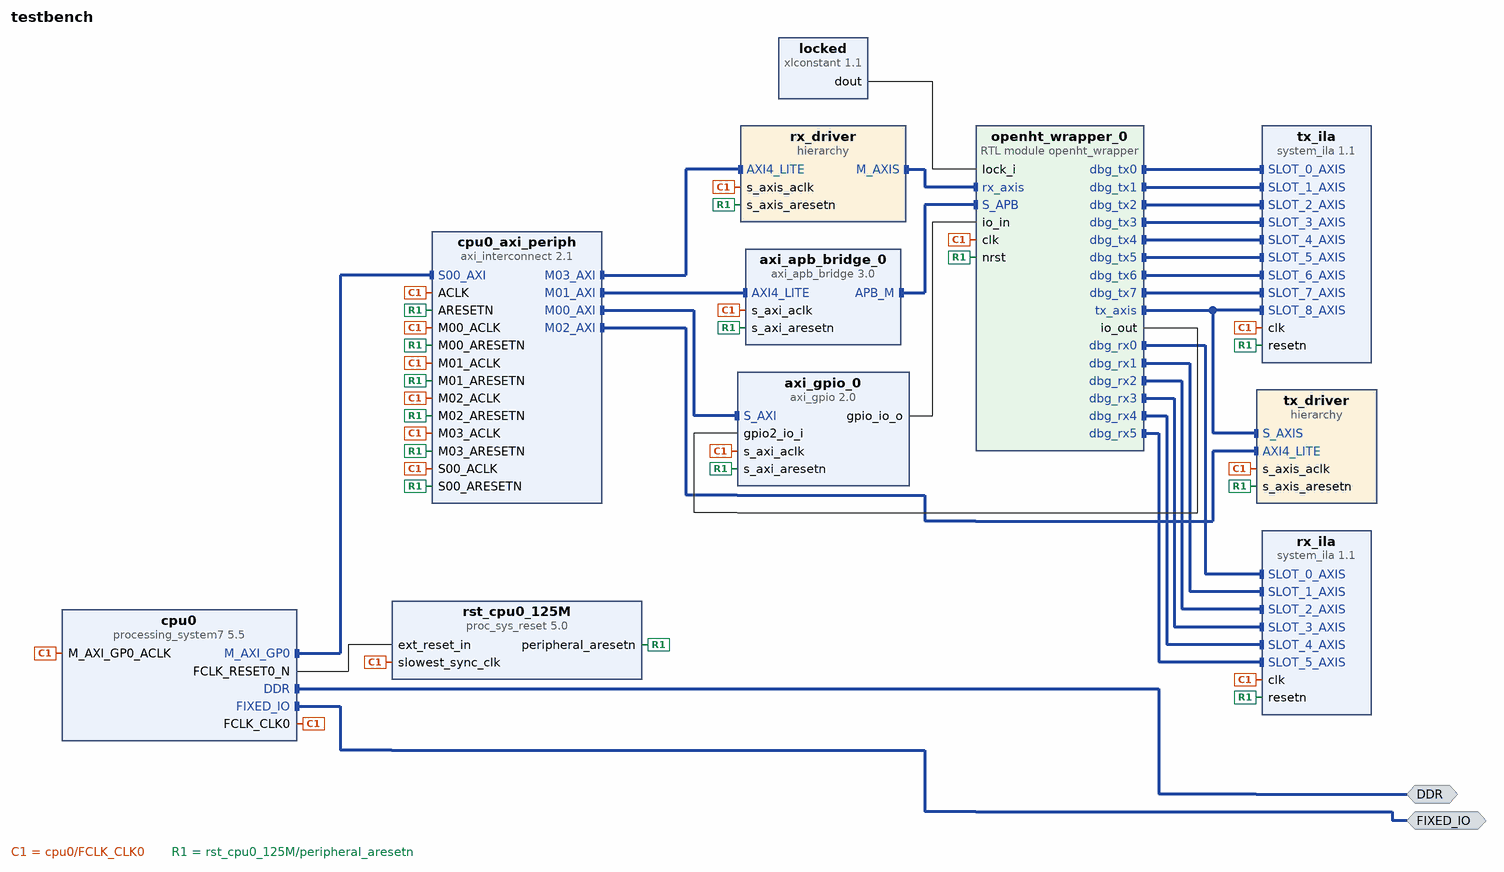
[diagram p0: block diagram of the top level]
# Vivado block design testbench, xc7z020clg400-1, Vivado 2023.1
create_bd_design testbench

create_bd_intf_port -mode Master -vlnv xilinx.com:interface:ddrx_rtl:1.0 DDR
create_bd_intf_port -mode Master -vlnv xilinx.com:display_processing_system7:fixedio_rtl:1.0 FIXED_IO

create_bd_cell -type ip -vlnv xilinx.com:ip:processing_system7:5.5 cpu0
set_property -dict [list \
  CONFIG.PCW_APU_PERIPHERAL_FREQMHZ 650 \
  CONFIG.PCW_CRYSTAL_PERIPHERAL_FREQMHZ 50 \
  CONFIG.PCW_ENET0_ENET0_IO {MIO 16 .. 27} \
  CONFIG.PCW_ENET0_GRP_MDIO_ENABLE 1 \
  CONFIG.PCW_ENET0_GRP_MDIO_IO {MIO 52 .. 53} \
  CONFIG.PCW_ENET0_PERIPHERAL_ENABLE 1 \
  CONFIG.PCW_ENET0_RESET_ENABLE 1 \
  CONFIG.PCW_ENET0_RESET_IO {MIO 9} \
  CONFIG.PCW_ENET_RESET_ENABLE 1 \
  CONFIG.PCW_ENET_RESET_SELECT {Share reset pin} \
  CONFIG.PCW_FPGA0_PERIPHERAL_FREQMHZ 100 \
  CONFIG.PCW_FPGA1_PERIPHERAL_FREQMHZ 50 \
  CONFIG.PCW_GPIO_MIO_GPIO_ENABLE 1 \
  CONFIG.PCW_GPIO_MIO_GPIO_IO MIO \
  CONFIG.PCW_I2C_RESET_ENABLE 1 \
  CONFIG.PCW_M_AXI_GP0_FREQMHZ 10 \
  CONFIG.PCW_PERIPHERAL_BOARD_PRESET part0 \
  CONFIG.PCW_PRESET_BANK1_VOLTAGE {LVCMOS 1.8V} \
  CONFIG.PCW_QSPI_GRP_FBCLK_ENABLE 1 \
  CONFIG.PCW_QSPI_GRP_FBCLK_IO {MIO 8} \
  CONFIG.PCW_QSPI_GRP_SINGLE_SS_ENABLE 1 \
  CONFIG.PCW_QSPI_GRP_SINGLE_SS_IO {MIO 1 .. 6} \
  CONFIG.PCW_QSPI_PERIPHERAL_ENABLE 1 \
  CONFIG.PCW_QSPI_QSPI_IO {MIO 1 .. 6} \
  CONFIG.PCW_SD0_GRP_CD_ENABLE 1 \
  CONFIG.PCW_SD0_GRP_CD_IO {MIO 47} \
  CONFIG.PCW_SD0_GRP_WP_ENABLE 0 \
  CONFIG.PCW_SD0_PERIPHERAL_ENABLE 1 \
  CONFIG.PCW_SD0_SD0_IO {MIO 40 .. 45} \
  CONFIG.PCW_SDIO_PERIPHERAL_FREQMHZ 50 \
  CONFIG.PCW_SINGLE_QSPI_DATA_MODE x4 \
  CONFIG.PCW_UART0_PERIPHERAL_ENABLE 1 \
  CONFIG.PCW_UART0_UART0_IO {MIO 14 .. 15} \
  CONFIG.PCW_UART1_PERIPHERAL_ENABLE 0 \
  CONFIG.PCW_UART_PERIPHERAL_FREQMHZ 100 \
  CONFIG.PCW_UIPARAM_DDR_BUS_WIDTH {16 Bit} \
  CONFIG.PCW_UIPARAM_DDR_FREQ_MHZ 525 \
  CONFIG.PCW_UIPARAM_DDR_PARTNO {MT41J256M16 RE-125} \
  CONFIG.PCW_USB0_PERIPHERAL_ENABLE 1 \
  CONFIG.PCW_USB0_RESET_ENABLE 1 \
  CONFIG.PCW_USB0_RESET_IO {MIO 46} \
  CONFIG.PCW_USB0_USB0_IO {MIO 28 .. 39} \
  CONFIG.PCW_USB_RESET_ENABLE 1 \
  CONFIG.PCW_USB_RESET_SELECT {Share reset pin} \
] [get_bd_cells cpu0]
# 486 more settings of cpu0 are not shown: defaults, MIO pin electricals, DDR timing, and values the tool derives
create_bd_cell -type ip -vlnv xilinx.com:ip:axi_gpio:2.0 axi_gpio_0
set_property -dict [list \
  CONFIG.C_ALL_INPUTS 0 \
  CONFIG.C_ALL_INPUTS_2 1 \
  CONFIG.C_ALL_OUTPUTS 1 \
  CONFIG.C_GPIO2_WIDTH 4 \
  CONFIG.C_GPIO_WIDTH 3 \
  CONFIG.C_IS_DUAL 1 \
  CONFIG.GPIO_BOARD_INTERFACE Custom \
  CONFIG.USE_BOARD_FLOW true \
] [get_bd_cells axi_gpio_0]
create_bd_cell -type ip -vlnv xilinx.com:ip:axi_interconnect:2.1 cpu0_axi_periph
set_property -dict {CONFIG.NUM_MI 4} [get_bd_cells cpu0_axi_periph]
create_bd_cell -type ip -vlnv xilinx.com:ip:proc_sys_reset:5.0 rst_cpu0_125M
create_bd_cell -type ip -vlnv xilinx.com:ip:axi_apb_bridge:3.0 axi_apb_bridge_0
set_property -dict {CONFIG.C_APB_NUM_SLAVES 1 CONFIG.C_M_APB_PROTOCOL apb4} [get_bd_cells axi_apb_bridge_0]
create_bd_cell -type ip -vlnv xilinx.com:ip:xlconstant:1.1 locked
create_bd_cell -type hier rx_driver
create_bd_cell -type hier tx_driver
create_bd_cell -type ip -vlnv xilinx.com:ip:system_ila:1.1 tx_ila
set_property -dict [list \
  CONFIG.C_DATA_DEPTH 4096 \
  CONFIG.C_EN_STRG_QUAL 1 \
  CONFIG.C_INPUT_PIPE_STAGES 1 \
  CONFIG.C_NUM_MONITOR_SLOTS 9 \
  CONFIG.C_SLOT 8 \
  CONFIG.C_SLOT_0_INTF_TYPE xilinx.com:interface:axis_rtl:1.0 \
  CONFIG.C_SLOT_1_INTF_TYPE xilinx.com:interface:axis_rtl:1.0 \
  CONFIG.C_SLOT_2_INTF_TYPE xilinx.com:interface:axis_rtl:1.0 \
  CONFIG.C_SLOT_3_INTF_TYPE xilinx.com:interface:axis_rtl:1.0 \
  CONFIG.C_SLOT_4_INTF_TYPE xilinx.com:interface:axis_rtl:1.0 \
  CONFIG.C_SLOT_5_INTF_TYPE xilinx.com:interface:axis_rtl:1.0 \
  CONFIG.C_SLOT_6_INTF_TYPE xilinx.com:interface:axis_rtl:1.0 \
  CONFIG.C_SLOT_7_INTF_TYPE xilinx.com:interface:axis_rtl:1.0 \
  CONFIG.C_SLOT_8_INTF_TYPE xilinx.com:interface:axis_rtl:1.0 \
] [get_bd_cells tx_ila]
create_bd_cell -type ip -vlnv xilinx.com:ip:system_ila:1.1 rx_ila
set_property -dict [list \
  CONFIG.C_DATA_DEPTH 4096 \
  CONFIG.C_EN_STRG_QUAL 1 \
  CONFIG.C_INPUT_PIPE_STAGES 1 \
  CONFIG.C_NUM_MONITOR_SLOTS 6 \
  CONFIG.C_SLOT 1 \
  CONFIG.C_SLOT_0_INTF_TYPE xilinx.com:interface:axis_rtl:1.0 \
  CONFIG.C_SLOT_1_INTF_TYPE xilinx.com:interface:axis_rtl:1.0 \
  CONFIG.C_SLOT_2_INTF_TYPE xilinx.com:interface:axis_rtl:1.0 \
  CONFIG.C_SLOT_3_INTF_TYPE xilinx.com:interface:axis_rtl:1.0 \
  CONFIG.C_SLOT_4_INTF_TYPE xilinx.com:interface:axis_rtl:1.0 \
  CONFIG.C_SLOT_5_INTF_TYPE xilinx.com:interface:axis_rtl:1.0 \
] [get_bd_cells rx_ila]
create_bd_cell -type module -reference openht_wrapper openht_wrapper_0

# ---- hierarchy /rx_driver ----
current_bd_instance /rx_driver
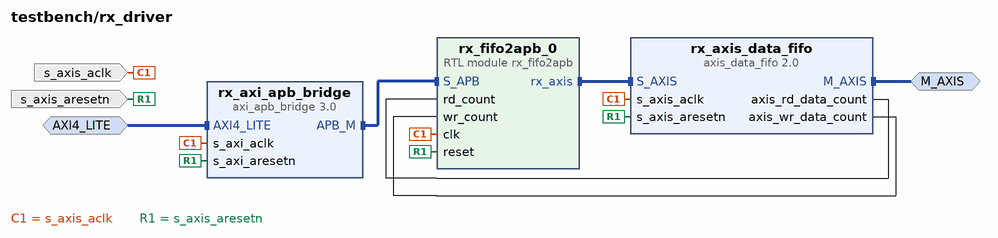
[diagram p1: block diagram inside /rx_driver]
create_bd_intf_pin -mode Slave -vlnv xilinx.com:interface:aximm_rtl:1.0 AXI4_LITE
create_bd_intf_pin -mode Master -vlnv xilinx.com:interface:axis_rtl:1.0 M_AXIS
create_bd_pin -dir I -type clk s_axis_aclk
create_bd_pin -dir I -type rst s_axis_aresetn

create_bd_cell -type ip -vlnv xilinx.com:ip:axi_apb_bridge:3.0 rx_axi_apb_bridge
set_property -dict {CONFIG.C_APB_NUM_SLAVES 1 CONFIG.C_M_APB_PROTOCOL apb4} [get_bd_cells rx_axi_apb_bridge]
create_bd_cell -type ip -vlnv xilinx.com:ip:axis_data_fifo:2.0 rx_axis_data_fifo
set_property -dict {CONFIG.HAS_RD_DATA_COUNT 1 CONFIG.HAS_WR_DATA_COUNT 1} [get_bd_cells rx_axis_data_fifo]
create_bd_cell -type module -reference rx_fifo2apb rx_fifo2apb_0

# ---- hierarchy /tx_driver ----
current_bd_instance /tx_driver
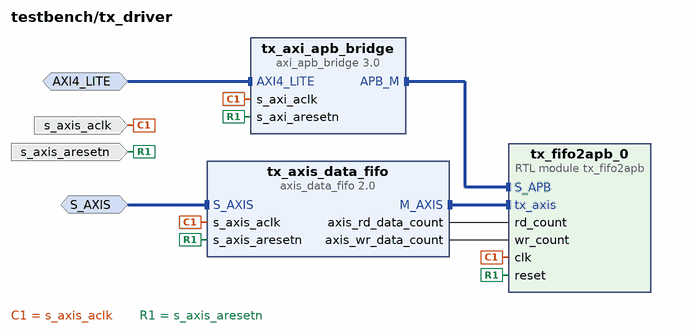
[diagram p2: block diagram inside /tx_driver]
create_bd_intf_pin -mode Slave -vlnv xilinx.com:interface:aximm_rtl:1.0 AXI4_LITE
create_bd_intf_pin -mode Slave -vlnv xilinx.com:interface:axis_rtl:1.0 S_AXIS
create_bd_pin -dir I -type clk s_axis_aclk
create_bd_pin -dir I -type rst s_axis_aresetn

create_bd_cell -type ip -vlnv xilinx.com:ip:axi_apb_bridge:3.0 tx_axi_apb_bridge
set_property -dict {CONFIG.C_APB_NUM_SLAVES 1 CONFIG.C_M_APB_PROTOCOL apb4} [get_bd_cells tx_axi_apb_bridge]
create_bd_cell -type ip -vlnv xilinx.com:ip:axis_data_fifo:2.0 tx_axis_data_fifo
set_property -dict [list \
  CONFIG.HAS_PROG_FULL 0 \
  CONFIG.HAS_RD_DATA_COUNT 1 \
  CONFIG.HAS_WR_DATA_COUNT 1 \
  CONFIG.TDATA_NUM_BYTES 4 \
] [get_bd_cells tx_axis_data_fifo]
create_bd_cell -type module -reference tx_fifo2apb tx_fifo2apb_0

# ---- connections ----

current_bd_instance /rx_driver
connect_bd_intf_net [get_bd_intf_pins AXI4_LITE] [get_bd_intf_pins rx_axi_apb_bridge/AXI4_LITE]
connect_bd_intf_net [get_bd_intf_pins rx_axi_apb_bridge/APB_M] [get_bd_intf_pins rx_fifo2apb_0/S_APB]
connect_bd_intf_net [get_bd_intf_pins M_AXIS] [get_bd_intf_pins rx_axis_data_fifo/M_AXIS]
connect_bd_intf_net [get_bd_intf_pins rx_fifo2apb_0/rx_axis] [get_bd_intf_pins rx_axis_data_fifo/S_AXIS]
connect_bd_net -net processing_system7_0_FCLK_CLK0 [get_bd_pins s_axis_aclk] \
  [get_bd_pins rx_axis_data_fifo/s_axis_aclk] [get_bd_pins rx_axi_apb_bridge/s_axi_aclk] [get_bd_pins rx_fifo2apb_0/clk]
connect_bd_net -net rst_cpu0_125M_peripheral_aresetn [get_bd_pins s_axis_aresetn] \
  [get_bd_pins rx_axis_data_fifo/s_axis_aresetn] [get_bd_pins rx_axi_apb_bridge/s_axi_aresetn] \
  [get_bd_pins rx_fifo2apb_0/reset]
connect_bd_net [get_bd_pins rx_axis_data_fifo/axis_rd_data_count] [get_bd_pins rx_fifo2apb_0/rd_count]
connect_bd_net [get_bd_pins rx_axis_data_fifo/axis_wr_data_count] [get_bd_pins rx_fifo2apb_0/wr_count]

current_bd_instance /tx_driver
connect_bd_intf_net -intf_net axi_apb_bridge_1_APB_M [get_bd_intf_pins tx_axi_apb_bridge/APB_M] [get_bd_intf_pins tx_fifo2apb_0/S_APB]
connect_bd_intf_net -intf_net axis_data_fifo_0_M_AXIS [get_bd_intf_pins tx_axis_data_fifo/M_AXIS] [get_bd_intf_pins tx_fifo2apb_0/tx_axis]
connect_bd_intf_net [get_bd_intf_pins AXI4_LITE] [get_bd_intf_pins tx_axi_apb_bridge/AXI4_LITE]
connect_bd_intf_net -intf_net openht_wrapper_0_tx_axis [get_bd_intf_pins S_AXIS] [get_bd_intf_pins tx_axis_data_fifo/S_AXIS]
connect_bd_net -net processing_system7_0_FCLK_CLK0 [get_bd_pins s_axis_aclk] \
  [get_bd_pins tx_axis_data_fifo/s_axis_aclk] [get_bd_pins tx_axi_apb_bridge/s_axi_aclk] [get_bd_pins tx_fifo2apb_0/clk]
connect_bd_net -net rst_cpu0_125M_peripheral_aresetn [get_bd_pins s_axis_aresetn] \
  [get_bd_pins tx_axis_data_fifo/s_axis_aresetn] [get_bd_pins tx_axi_apb_bridge/s_axi_aresetn] \
  [get_bd_pins tx_fifo2apb_0/reset]
connect_bd_net [get_bd_pins tx_axis_data_fifo/axis_rd_data_count] [get_bd_pins tx_fifo2apb_0/rd_count]
connect_bd_net [get_bd_pins tx_axis_data_fifo/axis_wr_data_count] [get_bd_pins tx_fifo2apb_0/wr_count]

current_bd_instance /
connect_bd_intf_net [get_bd_intf_pins axi_apb_bridge_0/APB_M] [get_bd_intf_pins openht_wrapper_0/S_APB]
connect_bd_intf_net [get_bd_intf_pins cpu0/M_AXI_GP0] [get_bd_intf_pins cpu0_axi_periph/S00_AXI]
connect_bd_intf_net [get_bd_intf_pins cpu0_axi_periph/M00_AXI] [get_bd_intf_pins axi_gpio_0/S_AXI]
connect_bd_intf_net [get_bd_intf_pins cpu0_axi_periph/M01_AXI] [get_bd_intf_pins axi_apb_bridge_0/AXI4_LITE]
connect_bd_intf_net [get_bd_intf_pins tx_driver/AXI4_LITE] [get_bd_intf_pins cpu0_axi_periph/M02_AXI]
connect_bd_intf_net [get_bd_intf_pins rx_driver/AXI4_LITE] [get_bd_intf_pins cpu0_axi_periph/M03_AXI]
connect_bd_intf_net [get_bd_intf_pins openht_wrapper_0/dbg_rx0] [get_bd_intf_pins rx_ila/SLOT_0_AXIS]
connect_bd_intf_net [get_bd_intf_pins openht_wrapper_0/dbg_rx1] [get_bd_intf_pins rx_ila/SLOT_1_AXIS]
connect_bd_intf_net [get_bd_intf_pins openht_wrapper_0/dbg_rx2] [get_bd_intf_pins rx_ila/SLOT_2_AXIS]
connect_bd_intf_net [get_bd_intf_pins openht_wrapper_0/dbg_rx3] [get_bd_intf_pins rx_ila/SLOT_3_AXIS]
connect_bd_intf_net [get_bd_intf_pins openht_wrapper_0/dbg_rx4] [get_bd_intf_pins rx_ila/SLOT_4_AXIS]
connect_bd_intf_net [get_bd_intf_pins openht_wrapper_0/dbg_rx5] [get_bd_intf_pins rx_ila/SLOT_5_AXIS]
connect_bd_intf_net [get_bd_intf_pins openht_wrapper_0/dbg_tx0] [get_bd_intf_pins tx_ila/SLOT_0_AXIS]
connect_bd_intf_net [get_bd_intf_pins openht_wrapper_0/dbg_tx1] [get_bd_intf_pins tx_ila/SLOT_1_AXIS]
connect_bd_intf_net [get_bd_intf_pins openht_wrapper_0/dbg_tx2] [get_bd_intf_pins tx_ila/SLOT_2_AXIS]
connect_bd_intf_net [get_bd_intf_pins openht_wrapper_0/dbg_tx3] [get_bd_intf_pins tx_ila/SLOT_3_AXIS]
connect_bd_intf_net [get_bd_intf_pins openht_wrapper_0/dbg_tx4] [get_bd_intf_pins tx_ila/SLOT_4_AXIS]
connect_bd_intf_net [get_bd_intf_pins openht_wrapper_0/dbg_tx5] [get_bd_intf_pins tx_ila/SLOT_5_AXIS]
connect_bd_intf_net [get_bd_intf_pins openht_wrapper_0/dbg_tx6] [get_bd_intf_pins tx_ila/SLOT_6_AXIS]
connect_bd_intf_net [get_bd_intf_pins openht_wrapper_0/dbg_tx7] [get_bd_intf_pins tx_ila/SLOT_7_AXIS]
connect_bd_intf_net [get_bd_intf_pins openht_wrapper_0/tx_axis] [get_bd_intf_pins tx_driver/S_AXIS]
connect_bd_intf_net [get_bd_intf_pins openht_wrapper_0/tx_axis] [get_bd_intf_pins tx_ila/SLOT_8_AXIS]
connect_bd_intf_net -intf_net processing_system7_0_DDR [get_bd_intf_ports DDR] [get_bd_intf_pins cpu0/DDR]
connect_bd_intf_net -intf_net processing_system7_0_FIXED_IO [get_bd_intf_ports FIXED_IO] [get_bd_intf_pins cpu0/FIXED_IO]
connect_bd_intf_net -intf_net rx_axis_data_fifo_M_AXIS [get_bd_intf_pins rx_driver/M_AXIS] [get_bd_intf_pins openht_wrapper_0/rx_axis]
connect_bd_net [get_bd_pins axi_gpio_0/gpio_io_o] [get_bd_pins openht_wrapper_0/io_in]
connect_bd_net [get_bd_pins cpu0/FCLK_RESET0_N] [get_bd_pins rst_cpu0_125M/ext_reset_in]
connect_bd_net [get_bd_pins locked/dout] [get_bd_pins openht_wrapper_0/lock_i]
connect_bd_net [get_bd_pins openht_wrapper_0/io_out] [get_bd_pins axi_gpio_0/gpio2_io_i]
connect_bd_net -net processing_system7_0_FCLK_CLK0 [get_bd_pins cpu0/FCLK_CLK0] \
  [get_bd_pins cpu0/M_AXI_GP0_ACLK] [get_bd_pins cpu0_axi_periph/S00_ACLK] [get_bd_pins rst_cpu0_125M/slowest_sync_clk] \
  [get_bd_pins axi_gpio_0/s_axi_aclk] [get_bd_pins cpu0_axi_periph/M00_ACLK] [get_bd_pins cpu0_axi_periph/ACLK] \
  [get_bd_pins cpu0_axi_periph/M01_ACLK] [get_bd_pins axi_apb_bridge_0/s_axi_aclk] [get_bd_pins cpu0_axi_periph/M02_ACLK] \
  [get_bd_pins cpu0_axi_periph/M03_ACLK] [get_bd_pins rx_driver/s_axis_aclk] [get_bd_pins tx_driver/s_axis_aclk] \
  [get_bd_pins tx_ila/clk] [get_bd_pins rx_ila/clk] [get_bd_pins openht_wrapper_0/clk]
connect_bd_net [get_bd_pins rst_cpu0_125M/peripheral_aresetn] \
  [get_bd_pins cpu0_axi_periph/S00_ARESETN] [get_bd_pins axi_gpio_0/s_axi_aresetn] [get_bd_pins cpu0_axi_periph/M00_ARESETN] \
  [get_bd_pins cpu0_axi_periph/ARESETN] [get_bd_pins cpu0_axi_periph/M01_ARESETN] \
  [get_bd_pins axi_apb_bridge_0/s_axi_aresetn] [get_bd_pins cpu0_axi_periph/M02_ARESETN] \
  [get_bd_pins cpu0_axi_periph/M03_ARESETN] [get_bd_pins rx_driver/s_axis_aresetn] [get_bd_pins tx_driver/s_axis_aresetn] \
  [get_bd_pins tx_ila/resetn] [get_bd_pins rx_ila/resetn] [get_bd_pins openht_wrapper_0/nrst]

# ---- address map ----
assign_bd_address -offset 0x41200000 -range 64K -target_address_space [get_bd_addr_spaces cpu0/Data] [get_bd_addr_segs axi_gpio_0/S_AXI/Reg]
assign_bd_address -offset 0x43C00000 -range 64K -target_address_space [get_bd_addr_spaces cpu0/Data] [get_bd_addr_segs openht_wrapper_0/S_APB/Reg]
assign_bd_address -offset 0x43C10000 -range 64K -target_address_space [get_bd_addr_spaces cpu0/Data] [get_bd_addr_segs rx_driver/rx_fifo2apb_0/S_APB/Reg]
assign_bd_address -offset 0x43C20000 -range 64K -target_address_space [get_bd_addr_spaces cpu0/Data] [get_bd_addr_segs tx_driver/tx_fifo2apb_0/S_APB/Reg]

validate_bd_design
save_bd_design
